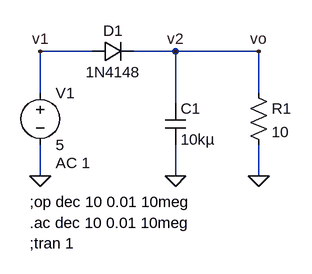
[diagram p0: schematic Circuit 1.asc]
Circuit 1.asc, the LTspice schematic file:
Version 4
SHEET 1 880 680
WIRE 32 112 -48 112
WIRE 160 112 96 112
WIRE 288 112 160 112
WIRE -48 176 -48 112
WIRE 288 176 288 112
WIRE 160 192 160 112
WIRE -48 304 -48 256
WIRE 160 304 160 256
WIRE 288 304 288 256
FLAG 288 304 0
FLAG 160 304 0
FLAG -48 304 0
FLAG 288 112 vo
FLAG -48 112 v1
FLAG 160 112 v2
SYMBOL res 272 160 R0
SYMATTR InstName R1
SYMATTR Value 10
SYMBOL cap 144 192 R0
SYMATTR InstName C1
SYMATTR Value 10kµ
SYMBOL voltage -48 160 R0
WINDOW 123 24 124 Left 2
WINDOW 39 0 0 Left 0
SYMATTR Value2 AC 1
SYMATTR InstName V1
SYMATTR Value 5
SYMBOL diode 32 128 R270
WINDOW 0 32 32 VTop 2
WINDOW 3 0 32 VBottom 2
SYMATTR InstName D1
SYMATTR Value 1N4148
TEXT -64 344 Left 2 !;op dec 10 0.01 10meg
TEXT -64 376 Left 2 !.ac dec 10 0.01 10meg
TEXT -64 408 Left 2 !;tran 1

The netlist it stands for:
* Circuit 1.asc
R1 v2 0 10
C1 v2 0 10kµ
V1 v1 0 5 AC 1
D1 v1 v2 1N4148
.model D D
.lib standard.dio
;op dec 10 0.01 10meg
.ac dec 10 0.01 10meg
;tran 1
.backanno
.end